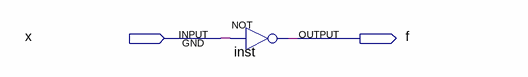
[diagram p0: schematic sheet]
// Quartus schematic 1-3-after.bdf as structural Verilog: 1 symbols, 2 pins
module \1-3-after  (
  input  x,
  output f
);

  not inst (f, x);
endmodule
